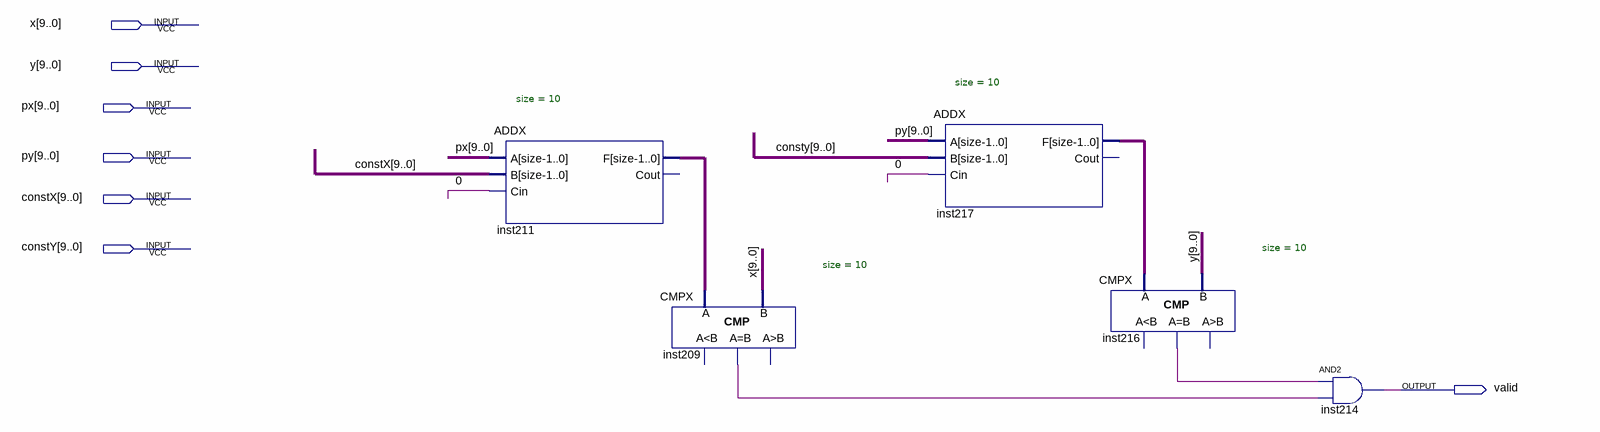
[diagram p0: schematic sheet]
// Quartus schematic tacka.bdf as structural Verilog: 5 symbols, 7 pins
module tacka (
  input  [9:0] x,
  input  [9:0] y,
  input  [9:0] px,
  input  [9:0] py,
  input  [9:0] constX,
  input  [9:0] constY,
  output valid
);

  wire \0 , inst209_eq, inst216_eq;
  wire [9:0] inst211_f, inst217_f;

  ADDX #(.size(10)) inst211 (.A(px), .B(constX), .Cin(\0 ), .F(inst211_f));  // open: Cout
  CMPX #(.size(10)) inst209 (.A(inst211_f), .B(x), .eq(inst209_eq));  // open: ls, gr
  ADDX #(.size(10)) inst217 (.A(py), .B(constY), .Cin(\0 ), .F(inst217_f));  // open: Cout
  CMPX #(.size(10)) inst216 (.A(inst217_f), .B(y), .eq(inst216_eq));  // open: ls, gr
  and inst214 (valid, inst216_eq, inst209_eq);
endmodule
